# EAGLE schematic loc_board1 (EAGLE 9.6.2)
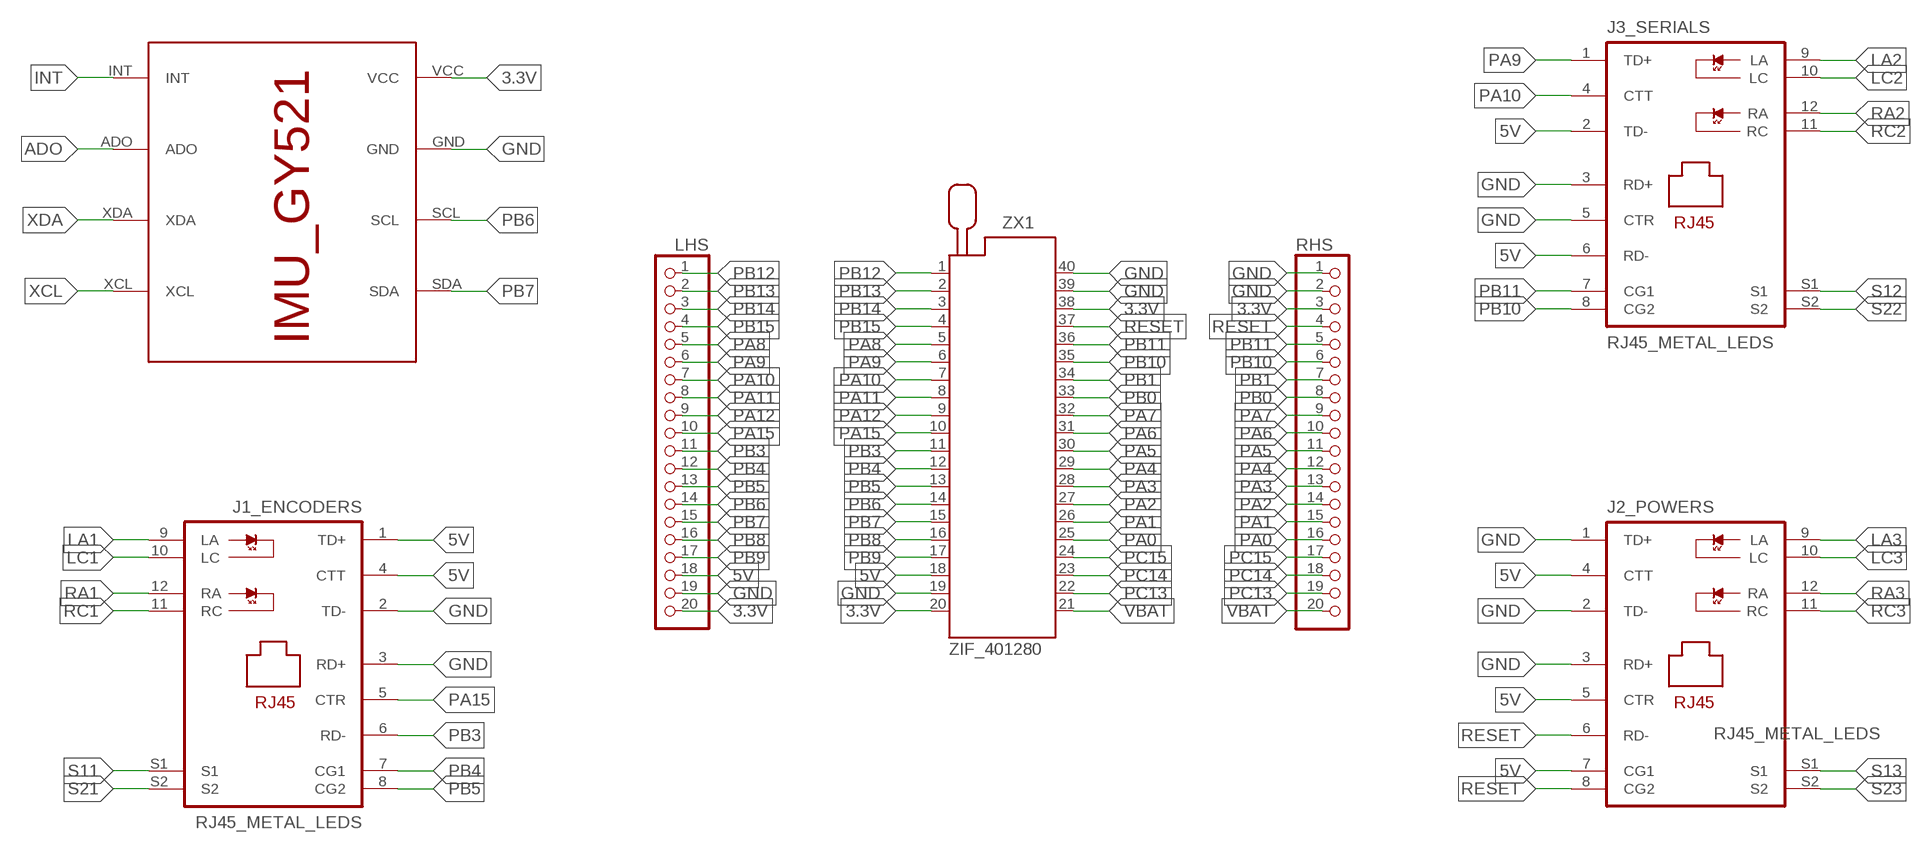
[diagram p0: schematic, sheet 1]

## Parts
IMU_  IMU_ROBOCON_GY521  [IMU_GY521]
J1_ENCODERS  RJ45_METAL_LEDS  [J0-A/B/F]
J2_POWERS  RJ45_METAL_LEDS  [J0-A/B/F]
J3_SERIALS  RJ45_METAL_LEDS  [J0-A/B/F]
LHS  PINHD-1X20  [1X20]
RHS  PINHD-1X20  [1X20]
ZX1  ZIF_401280  [240-1280-00-0602J]

## Nets
3.3V: IMU_.VCC LHS.20 RHS.3 ZX1.20 ZX1.38
5V: J1_ENCODERS.1(TD+) J1_ENCODERS.4(CTT) J2_POWERS.4(CTT) J2_POWERS.5(CTR) J2_POWERS.7(CG1) J3_SERIALS.2(TD-) J3_SERIALS.6(RD-) LHS.18 ZX1.18
ADO: IMU_.ADO
GND: IMU_.GND J1_ENCODERS.2(TD-) J1_ENCODERS.3(RD+) J2_POWERS.1(TD+) J2_POWERS.2(TD-) J2_POWERS.3(RD+) J3_SERIALS.3(RD+) J3_SERIALS.5(CTR) LHS.19 RHS.1 RHS.2 ZX1.19 ZX1.39 ZX1.40
INT: IMU_.INT
LA1: J1_ENCODERS.9(LA)
LA2: J3_SERIALS.9(LA)
LA3: J2_POWERS.9(LA)
LC1: J1_ENCODERS.10(LC)
LC2: J3_SERIALS.10(LC)
LC3: J2_POWERS.10(LC)
PA0: RHS.16 ZX1.25
PA1: RHS.15 ZX1.26
PA2: RHS.14 ZX1.27
PA3: RHS.13 ZX1.28
PA4: RHS.12 ZX1.29
PA5: RHS.11 ZX1.30
PA6: RHS.10 ZX1.31
PA7: RHS.9 ZX1.32
PA8: LHS.5 ZX1.5
PA9: J3_SERIALS.1(TD+) LHS.6 ZX1.6
PA10: J3_SERIALS.4(CTT) LHS.7 ZX1.7
PA11: LHS.8 ZX1.8
PA12: LHS.9 ZX1.9
PA15: J1_ENCODERS.5(CTR) LHS.10 ZX1.10
PB0: RHS.8 ZX1.33
PB1: RHS.7 ZX1.34
PB3: J1_ENCODERS.6(RD-) LHS.11 ZX1.11
PB4: J1_ENCODERS.7(CG1) LHS.12 ZX1.12
PB5: J1_ENCODERS.8(CG2) LHS.13 ZX1.13
PB6: IMU_.SCL LHS.14 ZX1.14
PB7: IMU_.SDA LHS.15 ZX1.15
PB8: LHS.16 ZX1.16
PB9: LHS.17 ZX1.17
PB10: J3_SERIALS.8(CG2) RHS.6 ZX1.35
PB11: J3_SERIALS.7(CG1) RHS.5 ZX1.36
PB12: LHS.1 ZX1.1
PB13: LHS.2 ZX1.2
PB14: LHS.3 ZX1.3
PB15: LHS.4 ZX1.4
PC13: RHS.19 ZX1.22
PC14: RHS.18 ZX1.23
PC15: RHS.17 ZX1.24
RA1: J1_ENCODERS.12(RA)
RA2: J3_SERIALS.12(RA)
RA3: J2_POWERS.12(RA)
RC1: J1_ENCODERS.11(RC)
RC2: J3_SERIALS.11(RC)
RC3: J2_POWERS.11(RC)
RESET: J2_POWERS.6(RD-) J2_POWERS.8(CG2) RHS.4 ZX1.37
S11: J1_ENCODERS.S1
S12: J3_SERIALS.S1
S13: J2_POWERS.S1
S21: J1_ENCODERS.S2
S22: J3_SERIALS.S2
S23: J2_POWERS.S2
VBAT: RHS.20 ZX1.21
XCL: IMU_.XCL
XDA: IMU_.XDA

## Library data of the parts
IMU_ = MIA_LIBRARY-2-2-2:IMU_ROBOCON_GY521
J1_ENCODERS J2_POWERS J3_SERIALS = MIA_LIBRARY-2-2-2:RJ45_METAL_LEDS: RJ45 PulseJack w/LEDs
LHS RHS = MIA_LIBRARY-2-2-2:PINHD-1X20: PIN HEADER
ZX1 = MIA_LIBRARY-2-2-2:ZIF_40: Zero Insertion Force Socked Source: http://www.3M.com/ehpd